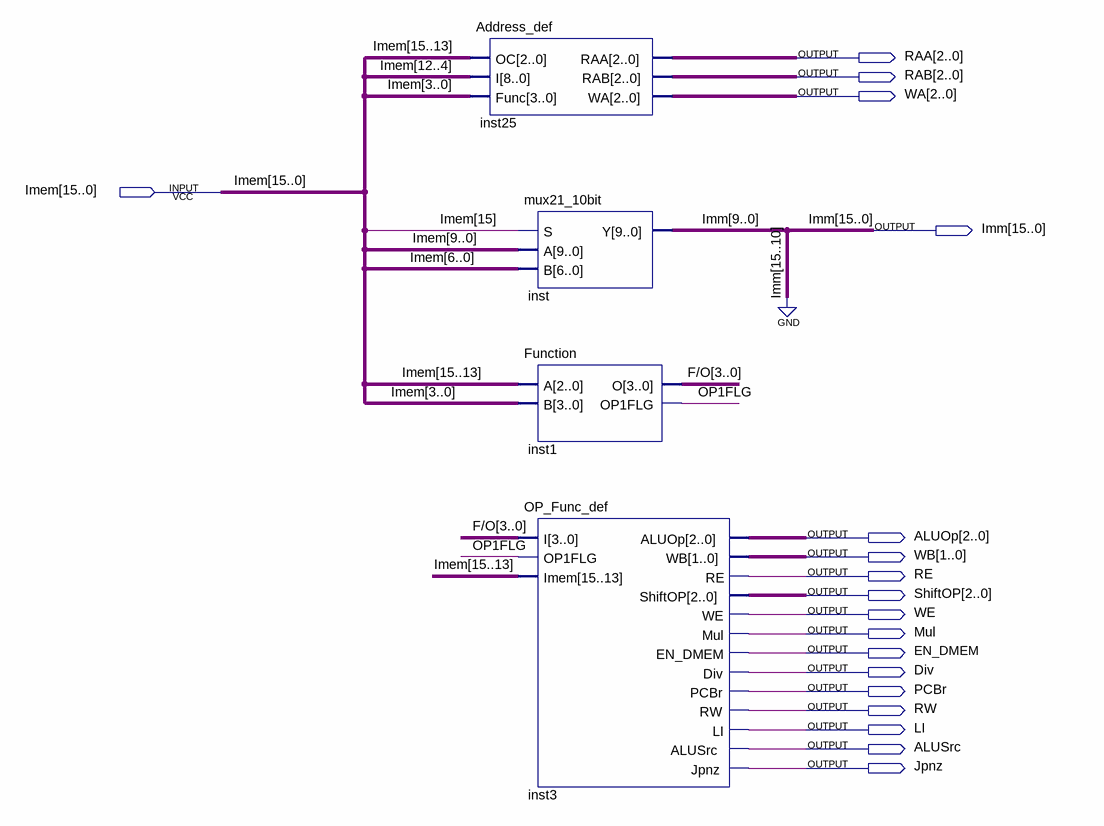
[diagram p0: schematic sheet]
// Quartus schematic Controller.bdf as structural Verilog: 4 symbols, 18 pins
module Controller (
  input  [15:0] Imem,
  output [2:0] RAA,
  output [2:0] RAB,
  output [2:0] WA,
  output [15:0] Imm,
  output [2:0] ALUOp,
  output [1:0] WB,
  output RE,
  output [2:0] ShiftOP,
  output WE,
  output Mul,
  output EN_DMEM,
  output Div,
  output PCBr,
  output RW,
  output LI,
  output ALUSrc,
  output Jpnz
);

  wire OP1FLG;
  wire [3:0] \F/O ;

  Address_def inst25 (.OC(Imem[15:13]), .I(Imem[12:4]), .Func(Imem[3:0]), .RAA(RAA), .RAB(RAB), .WA(WA));
  mux21_10bit inst (.S(Imem[15]), .A(Imem[9:0]), .B(Imem[6:0]), .Y(Imm[9:0]));
  Function inst1 (.A(Imem[15:13]), .B(Imem[3:0]), .O(\F/O ), .OP1FLG(OP1FLG));
  OP_Func_def inst3 (
    .I(\F/O ), .OP1FLG(OP1FLG), .Imem(Imem[15:13]), .ALUOp(ALUOp), .WB(WB), .RE(RE), .ShiftOP(ShiftOP),
    .WE(WE), .Mul(Mul), .EN_DMEM(EN_DMEM), .Div(Div), .PCBr(PCBr), .RW(RW), .LI(LI), .ALUSrc(ALUSrc),
    .Jpnz(Jpnz));

  assign Imm[15:10] = {6{1'b0}};
endmodule
